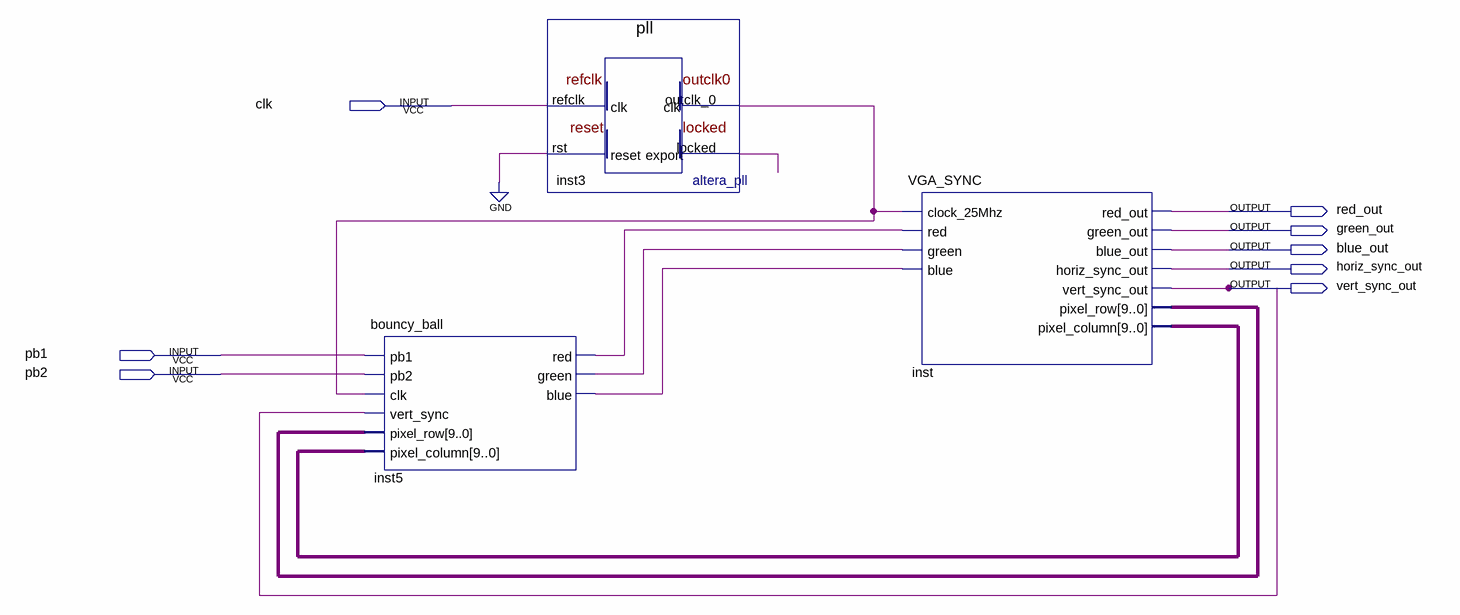
[diagram p0: schematic sheet]
// Quartus schematic main.bdf as structural Verilog: 3 symbols, 8 pins
module main (
  input  clk,
  input  pb1,
  input  pb2,
  output red_out,
  output green_out,
  output blue_out,
  output horiz_sync_out,
  output vert_sync_out
);

  wire inst3_locked, inst3_outclk_0, inst5_blue, inst5_green, inst5_red;
  wire [9:0] inst_pixel_column, inst_pixel_row;

  bouncy_ball inst5 (
    .pb1(pb1), .pb2(pb2), .clk(inst3_outclk_0), .vert_sync(vert_sync_out), .pixel_row(inst_pixel_row),
    .pixel_column(inst_pixel_column), .red(inst5_red), .green(inst5_green), .blue(inst5_blue));
  pll inst3 (.refclk(clk), .rst(1'b0), .outclk_0(inst3_outclk_0), .locked(inst3_locked));
  VGA_SYNC inst (
    .clock_25Mhz(inst3_outclk_0), .red(inst5_red), .green(inst5_green), .blue(inst5_blue), .red_out(red_out),
    .green_out(green_out), .blue_out(blue_out), .horiz_sync_out(horiz_sync_out),
    .vert_sync_out(vert_sync_out), .pixel_row(inst_pixel_row), .pixel_column(inst_pixel_column));
endmodule
